# Altium project projet.PrjPCB
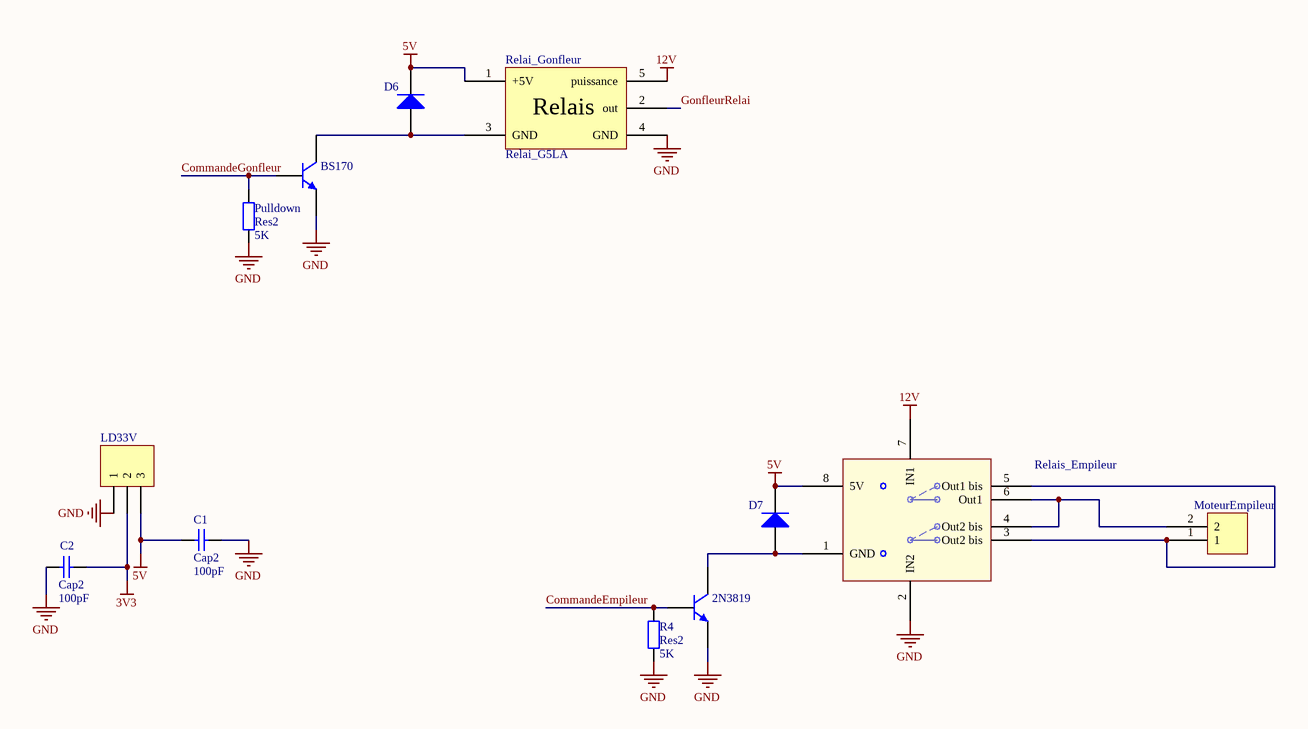
[diagram p0: Sheet1.SchDoc]
2 sheets, 43 parts. Net scope: global (net labels, ports and power ports of the same name join across sheets).
Board file: pcb.PcbDoc
Sheets:
  Sheet1.SchDoc
  int-out.SchDoc

## Sheet Sheet1.SchDoc
size A4

### Parts
2N3819  2N3904  [TO92]  (value not drawn)
BS170  2N3904  [TO92]  (value not drawn)
C1  Cap2  value 100pF  [CAPA2]
C2  Cap2  value 100pF  [CAPA2]
D6  Diode 1N4001  [Ddiode]  (value not drawn)
D7  Diode 1N4001  [Ddiode]  (value not drawn)
LD33V  Header 3  [HDR1X3]  (value not drawn)
MoteurEmpileur  Bornier  [Bornier]  (value not drawn)
Pulldown  Res2  value 5K  [res5_1/4W]
R4  Res2  value 5K  [res5_1/4W]
Relai_Gonfleur  Relai_G5LA  [Relai_g5la-1]
Relais_Empileur  Relais_MT2C93401  [Relais_MT2C93401]  (value not drawn)

### Nets
3V3: C2.2 LD33V.2
5V: C1.2 D6.2(K) D7.2(K) LD33V.3 Relai_Gonfleur.1(+5V) Relais_Empileur.8(5V)
12V: Relai_Gonfleur.5(puissance) Relais_Empileur.7(IN1)
GND: 2N3819.1(E) BS170.1(E) C1.1 C2.1 LD33V.1 Pulldown.1 R4.1 Relai_Gonfleur.4(GND) Relais_Empileur.2(IN2)
CommandeEmpileur: 2N3819.2(B) R4.2
CommandeGonfleur: BS170.2(B) Pulldown.2
GonfleurRelai: Relai_Gonfleur.2(out)
Net2N3819_3: 2N3819.3(C) D7.1(A) Relais_Empileur.1(GND)
NetBS170_3: BS170.3(C) D6.1(A) Relai_Gonfleur.3(GND)
NetMoteurEmpileur_1: MoteurEmpileur.1 Relais_Empileur.3(Out2_bis) Relais_Empileur.5(Out1_bis)
NetMoteurEmpileur_2: MoteurEmpileur.2 Relais_Empileur.4(Out2_bis) Relais_Empileur.6(Out1)

### Notes on the sheet
- (in symbol Relai_G5LA) Relais

### Library data of the parts
2N3819 BS170 = 2N3904: NPN General Purpose Amplifier; Published: 8-Jun-2000; LatestRevisionDate: 15-Jan-2003; LatestRevisionNote: PCB Footprint 'BCY-W3/D4.7' replaced; DatasheetDocument: 1997; PackageDocument: Sep-1998; PackageReference: TO-92A; Publisher: Altium Limited; Code_JEDEC: TO-92A; ComponentLink1Description: Manufacturer Link; ComponentLink1URL: http://www.fairchildsemi.com/; ComponentLink2Description: Datasheet; ComponentLink2URL: http://www.fairchildsemi.com/ds/2N%2F2N3904.pdf
C1 C2 = Cap2: Capacitor; Published: 8-Jun-2000; LatestRevisionDate: 17-Jul-2002; LatestRevisionNote: Re-released for DXP Platform.; PackageReference: RAD-0.3; Publisher: Altium Limited
D6 D7 = Diode 1N4001: 1 Amp General Purpose Rectifier; pin to pad: 1>A 2>K; Published: 8-Jun-2000; LatestRevisionDate: 17-Jul-2002; LatestRevisionNote: Re-released for DXP Platform.; DatasheetDocument: 1998; PackageDocument: Aug-1999; PackageReference: DO-41; Publisher: Altium Limited; Code_JEDEC: DO-204-AL; ComponentLink1Description: Manufacturer Link; ComponentLink1URL: http://www.fairchildsemi.com/; ComponentLink2Description: Datasheet; ComponentLink2URL: http://www.fairchildsemi.com/ds/1N%2F1N4001.pdf
LD33V = Header 3: Header, 3-Pin; LatestRevisionDate: 17-Jul-2002; LatestRevisionNote: Re-released for DXP Platform.; Publisher: Altium Limited
MoteurEmpileur = Bornier2
Pulldown R4 = Res2: Resistor; Published: 8-Jun-2000; LatestRevisionDate: 17-Jul-2002; LatestRevisionNote: Re-released for DXP Platform.; PackageReference: AXIAL-0.4; Publisher: Altium Limited

## Sheet int-out.SchDoc
size A4
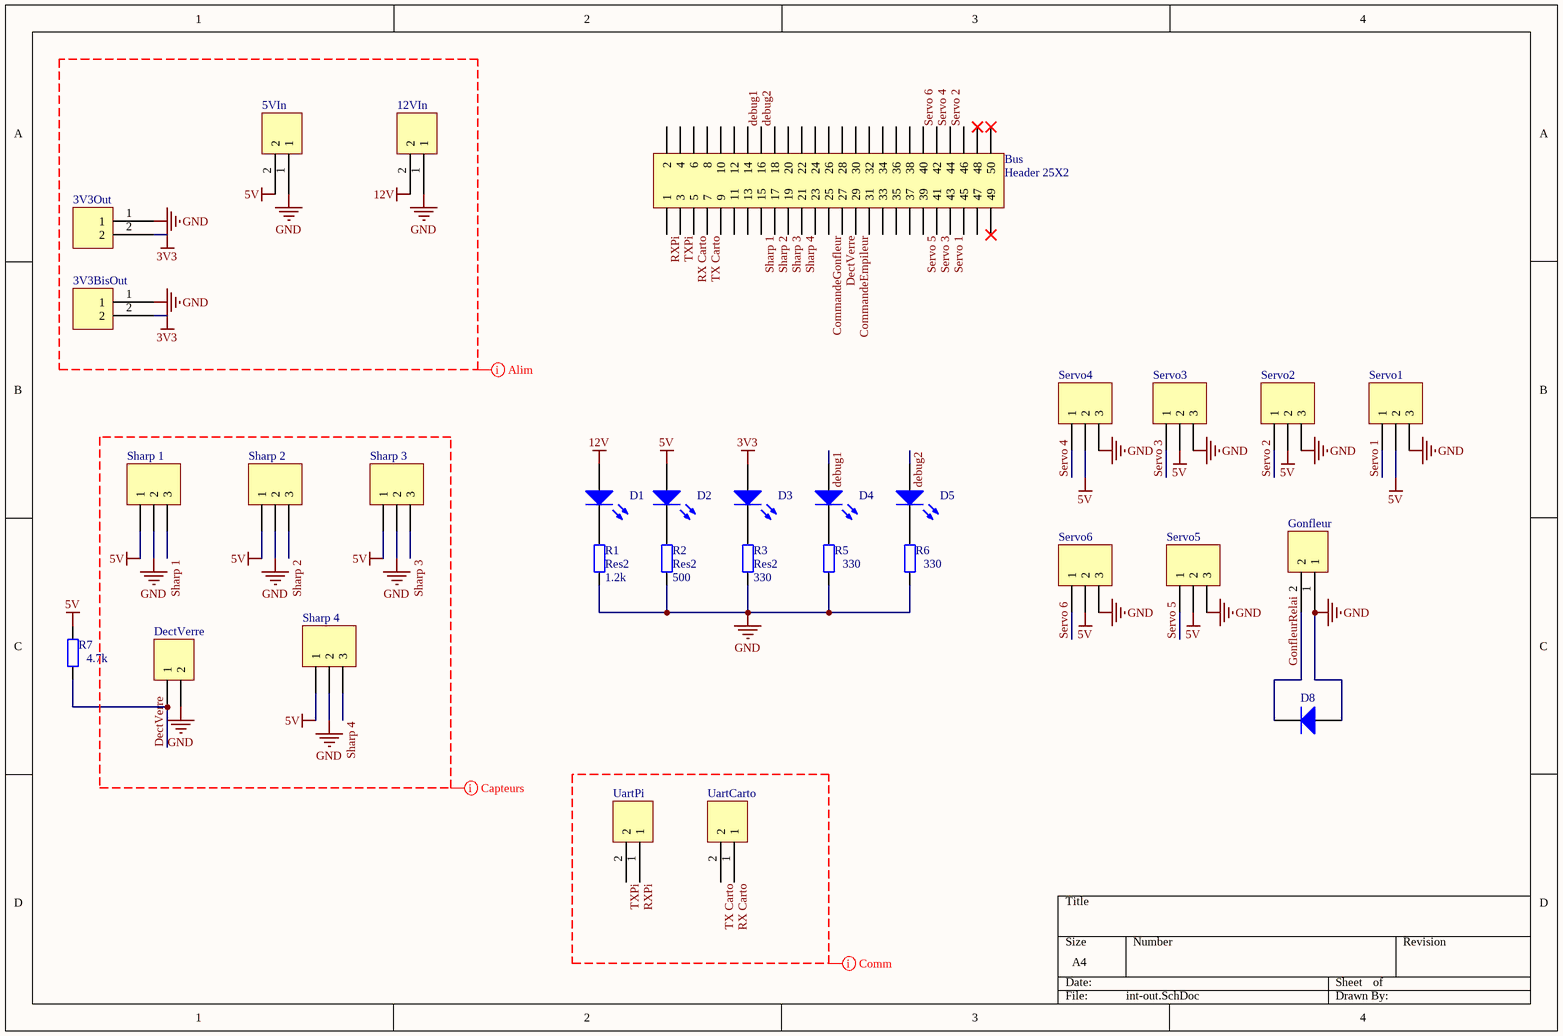
[diagram p1: int-out.SchDoc]

### Parts
3V3BisOut  Bornier  [Bornier]  (value not drawn)
3V3Out  Bornier  [Bornier]  (value not drawn)
5VIn  Bornier  [Bornier]  (value not drawn)
12VIn  Bornier  [Bornier]  (value not drawn)
Bus  Header 25X2  [HDR2X25]
D1  TSUS5202  [LED]  (value not drawn)
D2  TSUS5202  [LED]  (value not drawn)
D3  TSUS5202  [LED]  (value not drawn)
D4  TSUS5202  [LED]  (value not drawn)
D5  TSUS5202  [LED]  (value not drawn)
D8  Diode 1N4001  [Ddiode]  (value not drawn)
DectVerre  Header 2  [HDR1X2]  (value not drawn)
Gonfleur  Bornier  [Bornier]  (value not drawn)
R1  Res2  value 1.2k  [res5_1/4W]
R2  Res2  value 500  [res5_1/4W]
R3  Res2  value 330  [res5_1/4W]
R5  value 330  [res5_1/4W]  (hidden comment: Res2)
R6  value 330  [res5_1/4W]  (hidden comment: Res2)
R7  value 4.7k  [res5_1/4W]  (hidden comment: Res2)
Servo1  Header 3  [HDR1X3]  (value not drawn)
Servo2  Header 3  [HDR1X3]  (value not drawn)
Servo3  Header 3  [HDR1X3]  (value not drawn)
Servo4  Header 3  [HDR1X3]  (value not drawn)
Servo5  Header 3  [HDR1X3]  (value not drawn)
Servo6  Header 3  [HDR1X3]  (value not drawn)
Sharp_1  Header 3  [HDR1X3]  (value not drawn)
Sharp_2  Header 3  [HDR1X3]  (value not drawn)
Sharp_3  Header 3  [HDR1X3]  (value not drawn)
Sharp_4  Header 3  [HDR1X3]  (value not drawn)
UartCarto  Bornier  [Bornier]  (value not drawn)
UartPi  Bornier  [Bornier]  (value not drawn)

### Nets
3V3: 3V3BisOut.2 3V3Out.2 D3.1(A)
5V: 5VIn.2 D2.1(A) R7.1 Servo1.2 Servo2.2 Servo3.2 Servo4.2 Servo5.2 Servo6.2 Sharp_1.1 Sharp_2.1 Sharp_3.1 Sharp_4.1
12V: 12VIn.2 D1.1(A)
GND: 3V3BisOut.1 3V3Out.1 5VIn.1 12VIn.1 D8.1(A) DectVerre.2 Gonfleur.1 R1.2 R2.2 R3.2 R5.2 R6.2 Servo1.3 Servo2.3 Servo3.3 Servo4.3 Servo5.3 Servo6.3 Sharp_1.2 Sharp_2.2 Sharp_3.2 Sharp_4.2
CommandeEmpileur: Bus.29
CommandeGonfleur: Bus.25
debug1: Bus.16 D4.1(A)
debug2: Bus.18 D5.1(A)
DectVerre: Bus.27 DectVerre.1 R7.2
GonfleurRelai: D8.2(K) Gonfleur.2
RX Carto: Bus.5 UartCarto.1
RXPi: Bus.1 UartPi.1
Servo 1: Bus.43 Servo1.1
Servo 2: Bus.46 Servo2.1
Servo 3: Bus.41 Servo3.1
Servo 4: Bus.44 Servo4.1
Servo 5: Bus.39 Servo5.1
Servo 6: Bus.42 Servo6.1
Sharp 1: Bus.15 Sharp_1.3
Sharp 2: Bus.17 Sharp_2.3
Sharp 3: Bus.19 Sharp_3.3
Sharp 4: Bus.21 Sharp_4.3
TX Carto: Bus.7 UartCarto.2
TXPi: Bus.3 UartPi.2
NetD1_2: D1.2(K) R1.1
NetD2_2: D2.2(K) R2.1
NetD3_2: D3.2(K) R3.1
NetD4_2: D4.2(K) R5.1
NetD5_2: D5.2(K) R6.1

Not connected (* = marked no-connect by the designer): Bus 2 4 6 8 9 10 11 12 13 14 20 22 23 24 26 28 30 31 32 33 34 35 36 37 38 40 45 47 48* 49* 50*

### Layout directives
net class Alim: 3V3, 5V, 12V, GND
net class Undefined: 5V, DectVerre, GND, RX Carto, RXPi, Sharp 1, Sharp 2, Sharp 3, Sharp 4, TX Carto, TXPi

### Library data of the parts
3V3BisOut 3V3Out 5VIn 12VIn Gonfleur UartCarto UartPi = Bornier2
Bus = Header 25X2: Header, 25-Pin, Dual row; LatestRevisionDate: 17-Jul-2002; LatestRevisionNote: Re-released for DXP Platform.; Publisher: Altium Limited
D1-D5 = TSUS5202: LED_IR; Published: 8-Jun-2000; LatestRevisionDate: 17-Jul-2002; LatestRevisionNote: Re-released for DXP Platform.; DatasheetDocument: 1998; PackageDocument: Aug-1999; PackageReference: DO-41; Publisher: Altium Limited; Code_JEDEC: DO-204-AL; ComponentLink1Description: Manufacturer Link; ComponentLink1URL: http://www.fairchildsemi.com/; ComponentLink2Description: Datasheet; ComponentLink2URL: http://www.fairchildsemi.com/ds/1N%2F1N4001.pdf
D8 = Diode 1N4001: 1 Amp General Purpose Rectifier; pin to pad: 1>A 2>K; Published: 8-Jun-2000; LatestRevisionDate: 17-Jul-2002; LatestRevisionNote: Re-released for DXP Platform.; DatasheetDocument: 1998; PackageDocument: Aug-1999; PackageReference: DO-41; Publisher: Altium Limited; Code_JEDEC: DO-204-AL; ComponentLink1Description: Manufacturer Link; ComponentLink1URL: http://www.fairchildsemi.com/; ComponentLink2Description: Datasheet; ComponentLink2URL: http://www.fairchildsemi.com/ds/1N%2F1N4001.pdf
DectVerre = Header 2: Header, 2-Pin; LatestRevisionDate: 17-Jul-2002; LatestRevisionNote: Re-released for DXP Platform.; Publisher: Altium Limited
R1-R3 R5-R7 = Res2: Resistor; Published: 8-Jun-2000; LatestRevisionDate: 17-Jul-2002; LatestRevisionNote: Re-released for DXP Platform.; PackageReference: AXIAL-0.4; Publisher: Altium Limited
Servo1-Servo6 Sharp_1-Sharp_4 = Header 3: Header, 3-Pin; LatestRevisionDate: 17-Jul-2002; LatestRevisionNote: Re-released for DXP Platform.; Publisher: Altium Limited

## Nets that join several sheets
3V3: Sheet1 (C2.2 LD33V.2), int-out (3V3BisOut.2 3V3Out.2 D3.1)
5V: Sheet1 (6 pins), int-out (13 pins)
12V: Sheet1 (Relai_Gonfleur.5 Relais_Empileur.7), int-out (12VIn.2 D1.1)
GND: Sheet1 (9 pins), int-out (22 pins)
CommandeEmpileur: Sheet1 (2N3819.2 R4.2), int-out (Bus.29)
CommandeGonfleur: Sheet1 (BS170.2 Pulldown.2), int-out (Bus.25)
GonfleurRelai: Sheet1 (Relai_Gonfleur.2), int-out (D8.2 Gonfleur.2)